# EAGLE schematic puente (EAGLE 6.5.0)
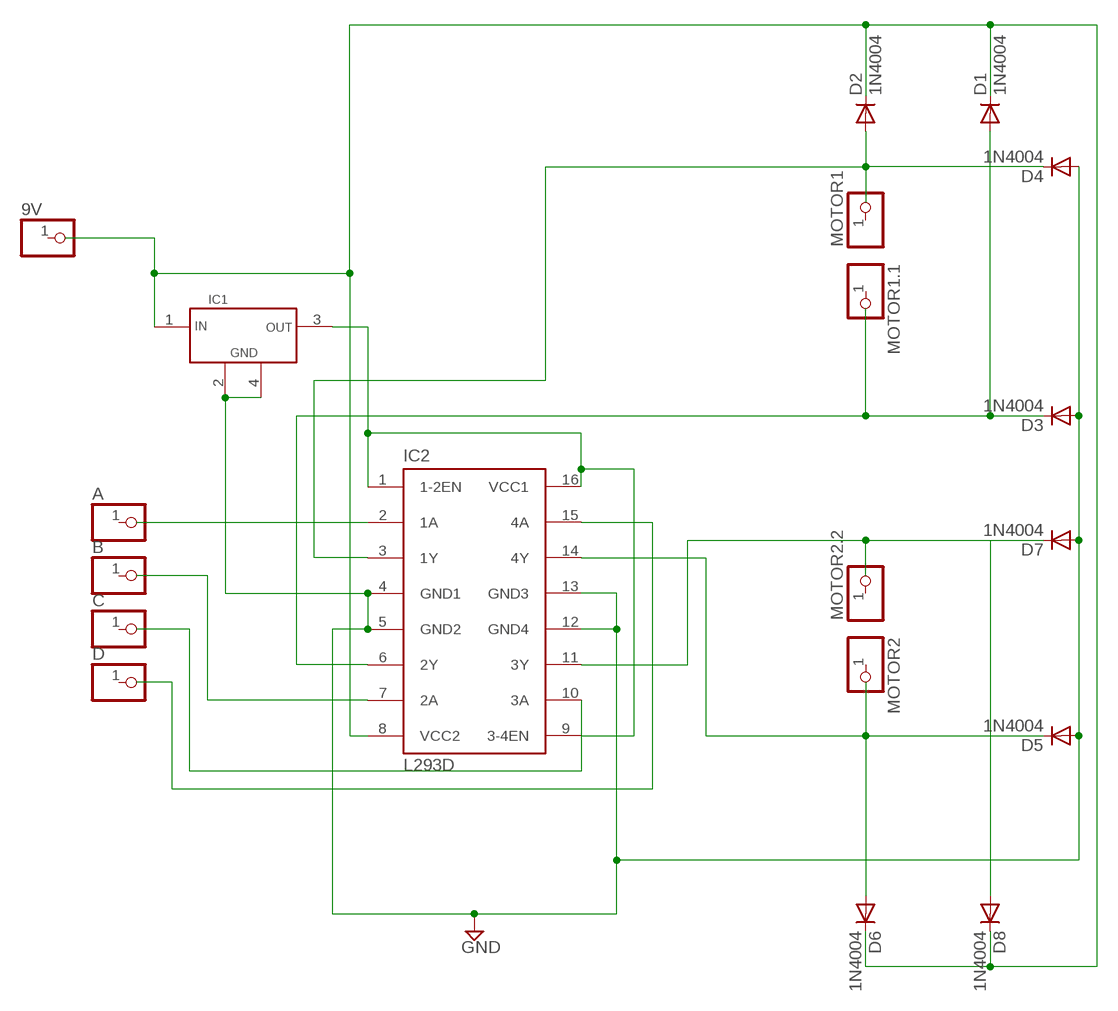
[diagram p0: schematic, sheet 1]

## Parts
9V  PINHD-1X1  [1X01]
A  PINHD-1X1  [1X01]
B  PINHD-1X1  [1X01]
C  PINHD-1X1  [1X01]
D  PINHD-1X1  [1X01]
D1  1N4004  [DO41-10]
D2  1N4004  [DO41-10]
D3  1N4004  [DO41-10]
D4  1N4004  [DO41-10]
D5  1N4004  [DO41-10]
D6  1N4004  [DO41-10]
D7  1N4004  [DO41-10]
D8  1N4004  [DO41-10]
IC1  7805  [SOT223]
IC2  L293D  [DIL16]
MOTOR1  PINHD-1X1  [1X01]
MOTOR1.1  PINHD-1X1  [1X01]
MOTOR2  PINHD-1X1  [1X01]
MOTOR2.2  PINHD-1X1  [1X01]

## Nets
GND: D3.A D4.A D5.A D7.A IC1.2(GND) IC1.4(GND) IC2.4(GND1) IC2.5(GND2) IC2.12(GND4) IC2.13(GND3)
N$1: D1.C D2.C D6.C D8.C IC1.1(IN) IC2.8(VCC2)
N$2: IC2.2(1A)
N$3: IC1.3(OUT) IC2.1(1-2EN) IC2.9(3-4EN) IC2.16(VCC1)
N$4: IC2.7(2A)
N$5: IC2.10(3A)
N$6: IC2.15(4A)
N$7: D2.A D4.C IC2.3(1Y)
N$9: D1.A D3.C IC2.6(2Y)
N$11: D7.C D8.A IC2.11(3Y)
N$12: D5.C D6.A IC2.14(4Y)
Unconnected: 9V.1 A.1 B.1 C.1 D.1 MOTOR1.1 MOTOR1.1.1 MOTOR2.1 MOTOR2.2.1

## Library data of the parts
9V A B C D MOTOR1 MOTOR1.1 MOTOR2 MOTOR2.2 = pinhead:PINHD-1X1: PIN HEADER
D1-D8 = diode:1N4004: DIODE general purpose rectifier, 1 A
IC1 = EYR_Reguladores:7805: Positive Voltaje Regulator 5V
IC2 = st-microelectronics:L293D: PUSH-PULL 4 CHANNEL DRIVER; MPN: L293D; OC_FARNELL: 9589619; OC_NEWARK: 56P8249